# EAGLE schematic BLDC driver board (EAGLE 6.2)
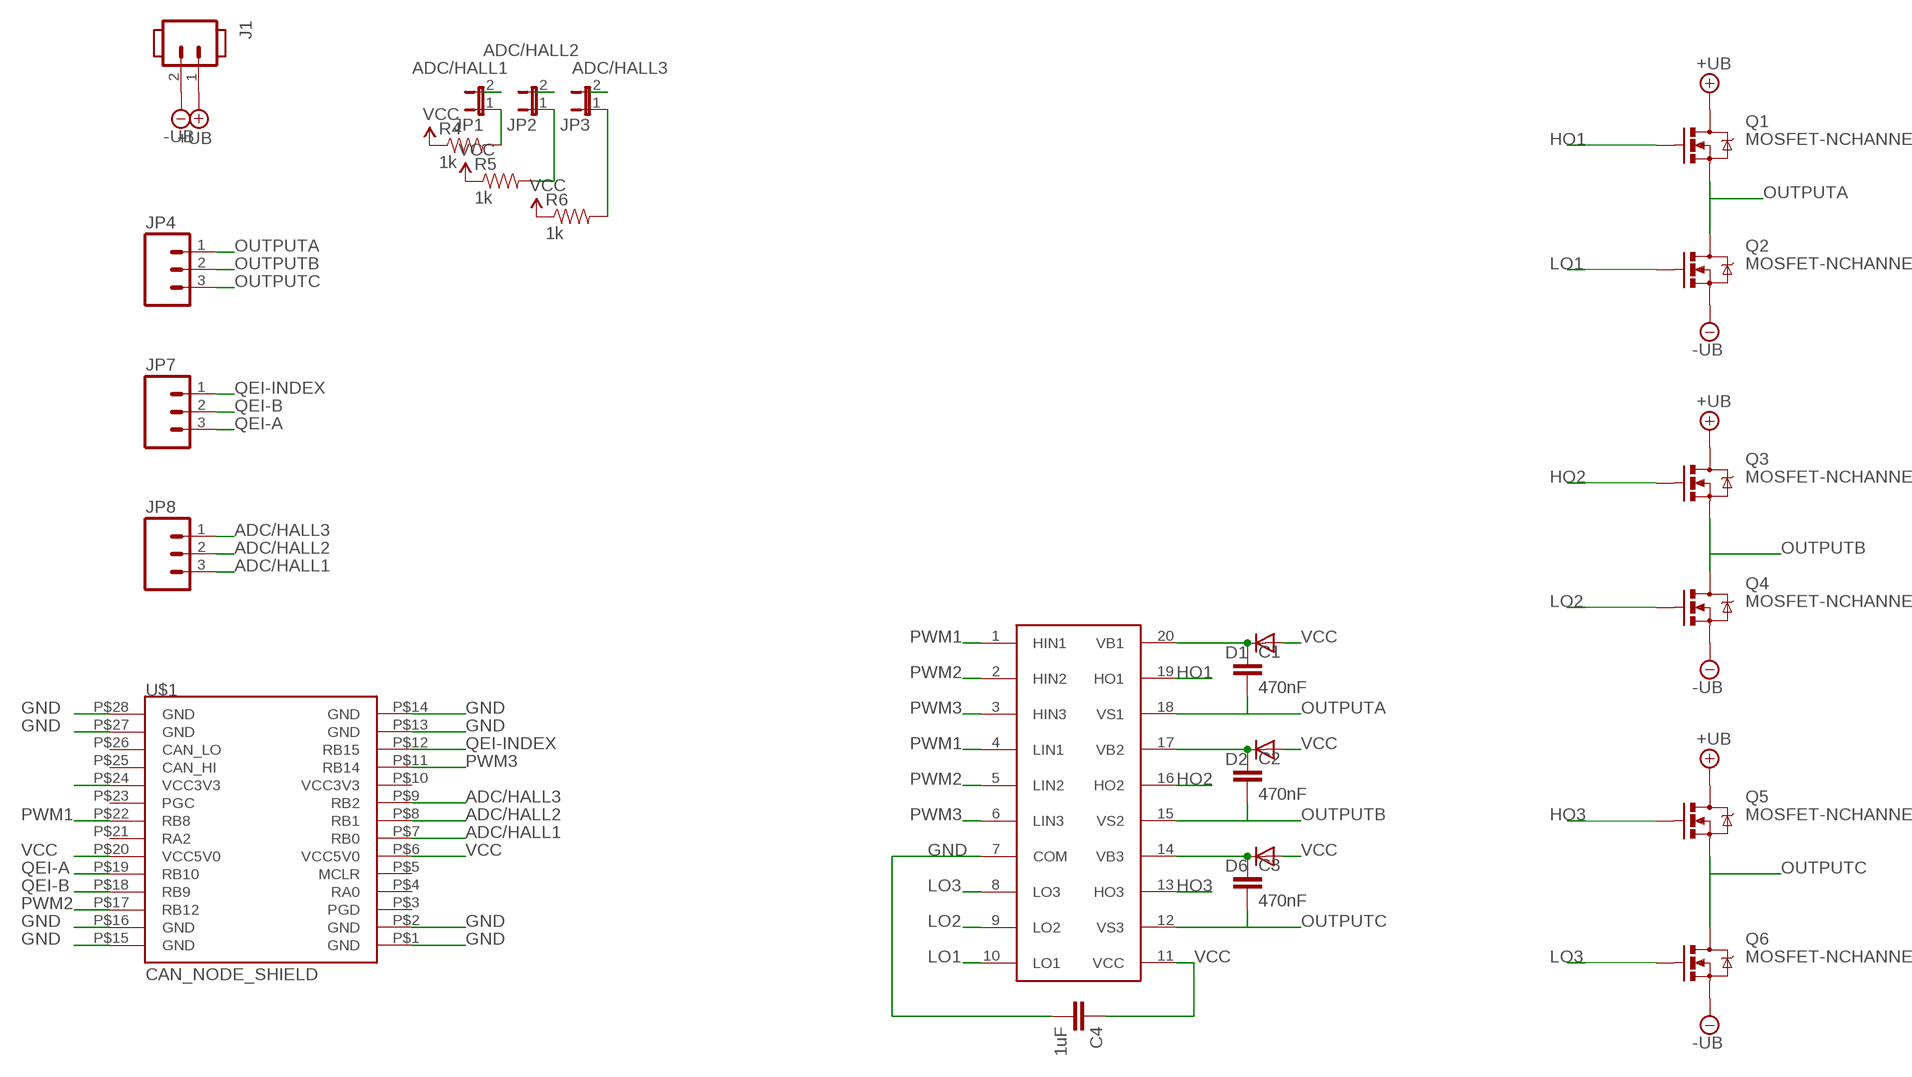
[diagram p0: schematic, sheet 1]

## Parts
C1  470nF  CAP1206  [1206]
C2  470nF  CAP1206  [1206]
C3  470nF  CAP1206  [1206]
C4  1uF  CAP1206  [1206]
D1  DIODEHV  [DIODE-HV]
D2  DIODEHV  [DIODE-HV]
D6  DIODEHV  [DIODE-HV]
J1  SCREWTERM02  [SCREW_TERMINAL-5.08MM-2]
JP1  JP1E  [JP1]
JP2  JP1E  [JP1]
JP3  JP1E  [JP1]
JP4  M03SCREW_LOCK  [SCREWTERMINAL-3.5MM-3_LOCK.007S]
JP7  M03LOCK_NO_SILK  [1X03_LOCK_NO_SILK]
JP8  M03LOCK_NO_SILK  [1X03_LOCK_NO_SILK]
Q1  MOSFET-NCHANNEL  [DPAK-VIA]
Q2  MOSFET-NCHANNEL  [DPAK-VIA]
Q3  MOSFET-NCHANNEL  [DPAK-VIA]
Q4  MOSFET-NCHANNEL  [DPAK-VIA]
Q5  MOSFET-NCHANNEL  [DPAK-VIA]
Q6  MOSFET-NCHANNEL  [DPAK-VIA]
R4  1k  RESISTOR1206  [1206]
R5  1k  RESISTOR1206  [1206]
R6  1k  RESISTOR1206  [1206]
U2  AUIRS2334S  [SO20W]
U$1  CAN_NODE_SHIELD  [CAN_NODE_SHIELD]

## Nets
+UB: J1.1 Q1.4(D) Q1.4@1(D) Q1.P$2(D) Q1.P$3(D) Q1.P$4(D) Q1.P$5(D) Q1.P$6(D) Q1.P$7(D) Q1.P$8(D) Q1.P$9(D) Q3.4(D) Q3.4@1(D) Q3.P$2(D) Q3.P$3(D) Q3.P$4(D) Q3.P$5(D) Q3.P$6(D) Q3.P$7(D) Q3.P$8(D) Q3.P$9(D) Q5.4(D) Q5.4@1(D) Q5.P$2(D) Q5.P$3(D) Q5.P$4(D) Q5.P$5(D) Q5.P$6(D) Q5.P$7(D) Q5.P$8(D) Q5.P$9(D)
-UB: J1.2 Q2.3(S) Q4.3(S) Q6.3(S)
ADC/HALL1: JP1.2 JP8.3 U$1.P$7(RB0)
ADC/HALL2: JP2.2 JP8.2 U$1.P$8(RB1)
ADC/HALL3: JP3.2 JP8.1 U$1.P$9(RB2)
GND: C4.2 U2.7(COM) U$1.P$1(GND) U$1.P$2(GND) U$1.P$13(GND) U$1.P$14(GND) U$1.P$15(GND) U$1.P$16(GND) U$1.P$27(GND) U$1.P$28(GND)
HO1: Q1.1(G) U2.19(HO1)
HO2: Q3.1(G) U2.16(HO2)
HO3: Q5.1(G) U2.13(HO3)
LO1: Q2.1(G) U2.10(LO1)
LO2: Q4.1(G) U2.9(LO2)
LO3: Q6.1(G) U2.8(LO3)
N$2: U$1.P$24(VCC3V3)
N$3: C1.1 D1.C U2.20(VB1)
N$7: C2.1 D2.C U2.17(VB2)
N$11: C3.1 D6.C U2.14(VB3)
N$26: JP1.1 R4.2
N$27: JP2.1 R5.2
N$28: JP3.1 R6.2
OUTPUTA: C1.2 JP4.1 Q1.3(S) Q2.4(D) Q2.4@1(D) Q2.P$2(D) Q2.P$3(D) Q2.P$4(D) Q2.P$5(D) Q2.P$6(D) Q2.P$7(D) Q2.P$8(D) Q2.P$9(D) U2.18(VS1)
OUTPUTB: C2.2 JP4.2 Q3.3(S) Q4.4(D) Q4.4@1(D) Q4.P$2(D) Q4.P$3(D) Q4.P$4(D) Q4.P$5(D) Q4.P$6(D) Q4.P$7(D) Q4.P$8(D) Q4.P$9(D) U2.15(VS2)
OUTPUTC: C3.2 JP4.3 Q5.3(S) Q6.4(D) Q6.4@1(D) Q6.P$2(D) Q6.P$3(D) Q6.P$4(D) Q6.P$5(D) Q6.P$6(D) Q6.P$7(D) Q6.P$8(D) Q6.P$9(D) U2.12(VS3)
PWM1: U2.1(HIN1) U2.4(LIN1) U$1.P$22(RB8)
PWM2: U2.2(HIN2) U2.5(LIN2) U$1.P$17(RB12)
PWM3: U2.3(HIN3) U2.6(LIN3) U$1.P$11(RB14)
QEI-A: JP7.3 U$1.P$19(RB10)
QEI-B: JP7.2 U$1.P$18(RB9)
QEI-INDEX: JP7.1 U$1.P$12(RB15)
VCC: C4.1 D1.A D2.A D6.A R4.1 R5.1 R6.1 U2.11(VCC) U$1.P$6(VCC5V0) U$1.P$20(VCC5V0)
Unconnected: U$1.P$3(PGD) U$1.P$4(RA0) U$1.P$5(MCLR) U$1.P$10(VCC3V3) U$1.P$21(RA2) U$1.P$23(PGC) U$1.P$25(CAN_HI) U$1.P$26(CAN_LO)

## Library data of the parts
C1-C4 = CMPE118lib:CAP: Capacitor Standard 0603 ceramic capacitor, and 0.1" leaded capacitor.
D1 D2 D6 = CMPE118lib:DIODE: Diode These are standard reverse protection diodes and small signal diodes. SMA package can handle up to about 1A. SOD-323 can handle about 200mA. What the SOD-323 package when ordering, there are some mfgs out there that are 5-pin packages.
J1 = CMPE118lib:SCREWTERM02
JP1-JP3 = jumper:JP1E: JUMPER
JP4 JP7 JP8 = CMPE118lib:M03: Header 3 Standard 3-pin 0.1" header. Use with straight break away headers (SKU : PRT-00116), right angle break away headers (PRT-00553), swiss pins (PRT-00743), machine pins (PRT-00117), and female headers (PRT-00115). Molex polarized connector foot print use with SKU : PRT-08232 with associated crimp pins and housings.
Q1-Q6 = ASL:MOSFET-NCHANNEL: Generic NMOS footprint
R4-R6 = CMPE118lib:RESISTOR: Resistor Basic schematic elements and footprints for 0603, 1206, and PTH resistors.
U2 = ASL:AUIRS2334S; AUIRS2334S: U
U$1 = ASL:CAN_NODE_SHIELD: A shield part for the dsPIC33f CAN node.